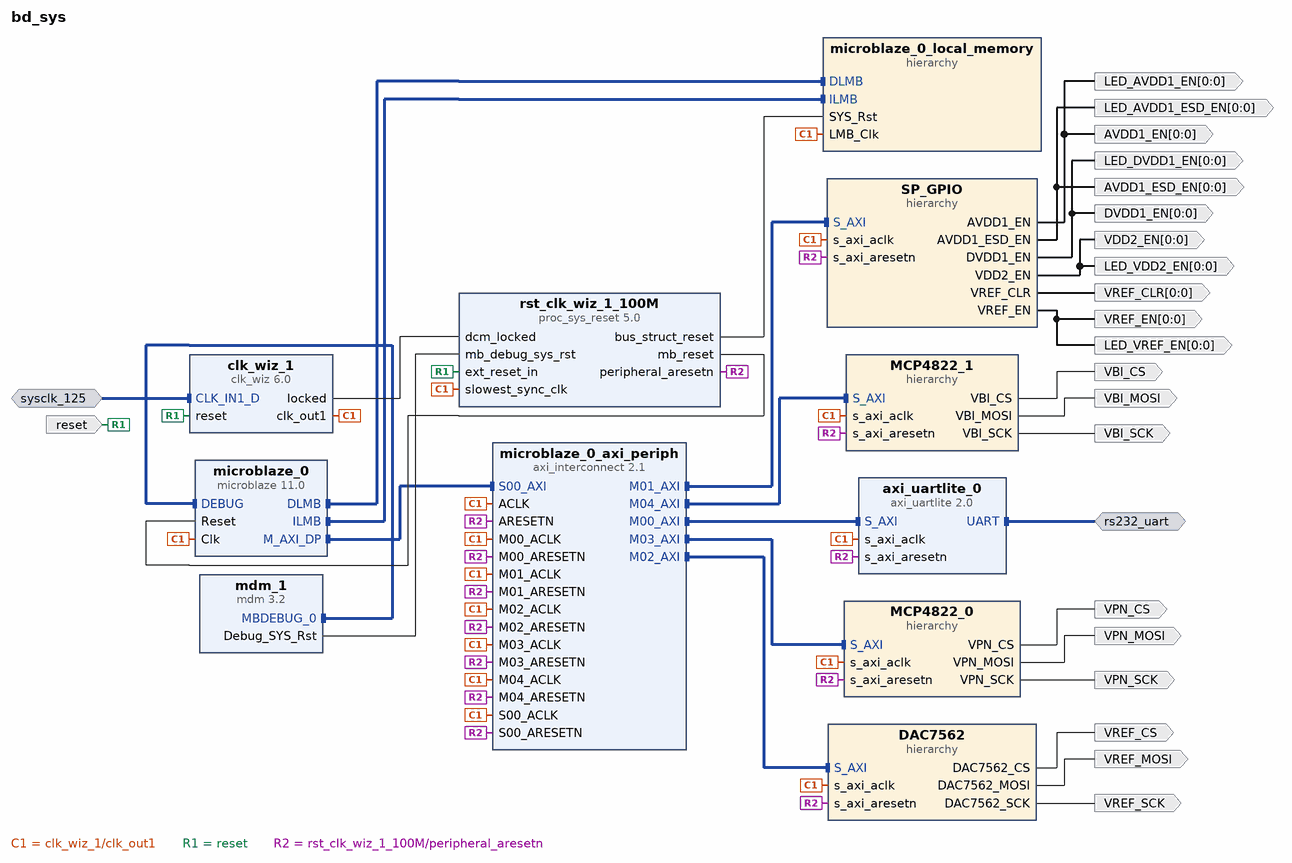
[diagram p0: block diagram of the top level]
# Vivado block design bd_sys, xcvu9p-flga2104-2L-e, Vivado 2019.1
create_bd_design bd_sys

create_bd_intf_port -mode Slave -vlnv xilinx.com:interface:diff_clock_rtl:1.0 sysclk_125
set_property -dict {CONFIG.FREQ_HZ 125000000} [get_bd_intf_ports sysclk_125]
create_bd_intf_port -mode Master -vlnv xilinx.com:interface:uart_rtl:1.0 rs232_uart
create_bd_port -dir I -type rst reset
set_property -dict {CONFIG.POLARITY ACTIVE_HIGH} [get_bd_ports reset]
create_bd_port -dir O -from 0 -to 0 AVDD1_EN
create_bd_port -dir O -from 0 -to 0 AVDD1_ESD_EN
create_bd_port -dir O -from 0 -to 0 DVDD1_EN
create_bd_port -dir O -from 0 -to 0 VDD2_EN
create_bd_port -dir O -from 0 -to 0 VREF_CLR
create_bd_port -dir O -from 0 -to 0 VREF_EN
create_bd_port -dir O -from 0 -to 0 LED_VDD2_EN
create_bd_port -dir O -from 0 -to 0 LED_AVDD1_ESD_EN
create_bd_port -dir O -from 0 -to 0 LED_AVDD1_EN
create_bd_port -dir O -from 0 -to 0 LED_DVDD1_EN
create_bd_port -dir O -from 0 -to 0 LED_VREF_EN
create_bd_port -dir O VREF_CS
create_bd_port -dir O VREF_MOSI
create_bd_port -dir O VREF_SCK
create_bd_port -dir O VPN_SCK
create_bd_port -dir O VPN_CS
create_bd_port -dir O VPN_MOSI
create_bd_port -dir O VBI_CS
create_bd_port -dir O VBI_MOSI
create_bd_port -dir O VBI_SCK

create_bd_cell -type ip -vlnv xilinx.com:ip:microblaze:11.0 microblaze_0
set_property -dict {CONFIG.C_DEBUG_ENABLED 1 CONFIG.C_D_AXI 1 CONFIG.C_D_LMB 1 CONFIG.C_I_LMB 1} [get_bd_cells microblaze_0]
create_bd_cell -type hier microblaze_0_local_memory
create_bd_cell -type ip -vlnv xilinx.com:ip:mdm:3.2 mdm_1
create_bd_cell -type ip -vlnv xilinx.com:ip:clk_wiz:6.0 clk_wiz_1
set_property -dict [list \
  CONFIG.CLKIN1_JITTER_PS 80.0 \
  CONFIG.CLKOUT1_JITTER 177.983 \
  CONFIG.CLKOUT1_PHASE_ERROR 222.305 \
  CONFIG.CLK_IN1_BOARD_INTERFACE sysclk_125 \
  CONFIG.MMCM_CLKFBOUT_MULT_F 48.000 \
  CONFIG.MMCM_CLKIN1_PERIOD 8.000 \
  CONFIG.MMCM_CLKIN2_PERIOD 10.000 \
  CONFIG.PRIM_SOURCE Differential_clock_capable_pin \
  CONFIG.RESET_BOARD_INTERFACE reset \
  CONFIG.USE_BOARD_FLOW true \
] [get_bd_cells clk_wiz_1]
create_bd_cell -type ip -vlnv xilinx.com:ip:proc_sys_reset:5.0 rst_clk_wiz_1_100M
set_property -dict {CONFIG.RESET_BOARD_INTERFACE reset CONFIG.USE_BOARD_FLOW true} [get_bd_cells rst_clk_wiz_1_100M]
create_bd_cell -type ip -vlnv xilinx.com:ip:axi_uartlite:2.0 axi_uartlite_0
set_property -dict [list \
  CONFIG.C_BAUDRATE 115200 \
  CONFIG.UARTLITE_BOARD_INTERFACE rs232_uart \
  CONFIG.USE_BOARD_FLOW true \
] [get_bd_cells axi_uartlite_0]
create_bd_cell -type ip -vlnv xilinx.com:ip:axi_interconnect:2.1 microblaze_0_axi_periph
set_property -dict {CONFIG.NUM_MI 5} [get_bd_cells microblaze_0_axi_periph]
create_bd_cell -type hier SP_GPIO
create_bd_cell -type hier DAC7562
create_bd_cell -type hier MCP4822_0
create_bd_cell -type hier MCP4822_1

# ---- hierarchy /microblaze_0_local_memory ----
current_bd_instance /microblaze_0_local_memory
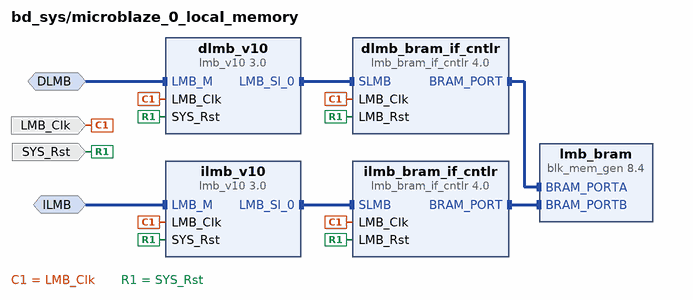
[diagram p1: block diagram inside /microblaze_0_local_memory]
create_bd_intf_pin -mode MirroredMaster -vlnv xilinx.com:interface:lmb_rtl:1.0 DLMB
create_bd_intf_pin -mode MirroredMaster -vlnv xilinx.com:interface:lmb_rtl:1.0 ILMB
create_bd_pin -dir I -type clk LMB_Clk
create_bd_pin -dir I -type rst SYS_Rst

create_bd_cell -type ip -vlnv xilinx.com:ip:lmb_v10:3.0 dlmb_v10
create_bd_cell -type ip -vlnv xilinx.com:ip:lmb_v10:3.0 ilmb_v10
create_bd_cell -type ip -vlnv xilinx.com:ip:lmb_bram_if_cntlr:4.0 dlmb_bram_if_cntlr
set_property -dict {CONFIG.C_ECC 0} [get_bd_cells dlmb_bram_if_cntlr]
create_bd_cell -type ip -vlnv xilinx.com:ip:lmb_bram_if_cntlr:4.0 ilmb_bram_if_cntlr
set_property -dict {CONFIG.C_ECC 0} [get_bd_cells ilmb_bram_if_cntlr]
create_bd_cell -type ip -vlnv xilinx.com:ip:blk_mem_gen:8.4 lmb_bram
set_property -dict {CONFIG.Memory_Type True_Dual_Port_RAM CONFIG.use_bram_block BRAM_Controller} [get_bd_cells lmb_bram]

# ---- hierarchy /SP_GPIO ----
current_bd_instance /SP_GPIO
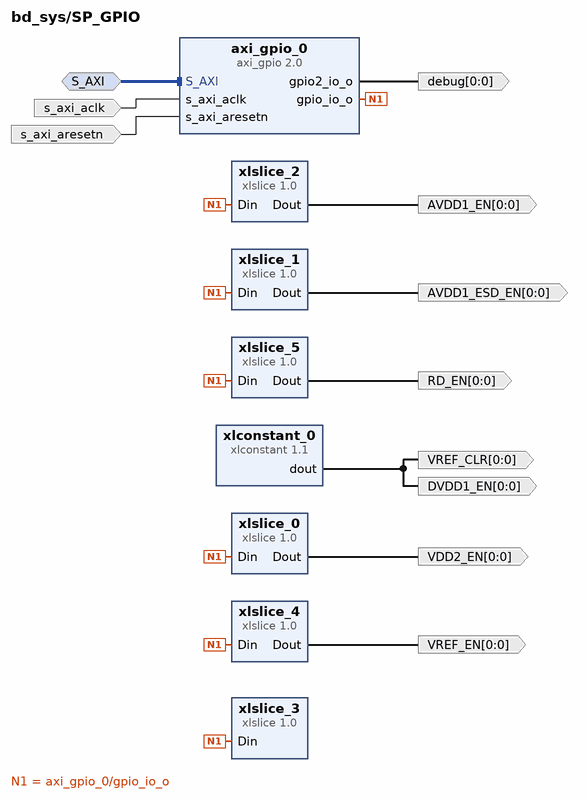
[diagram p2: block diagram inside /SP_GPIO]
create_bd_intf_pin -mode Slave -vlnv xilinx.com:interface:aximm_rtl:1.0 S_AXI
create_bd_pin -dir I -type clk s_axi_aclk
create_bd_pin -dir I -type rst s_axi_aresetn
create_bd_pin -dir O -from 0 -to 0 VREF_CLR
create_bd_pin -dir O -from 0 -to 0 VDD2_EN
create_bd_pin -dir O -from 0 -to 0 AVDD1_ESD_EN
create_bd_pin -dir O -from 0 -to 0 AVDD1_EN
create_bd_pin -dir O -from 0 -to 0 DVDD1_EN
create_bd_pin -dir O -from 0 -to 0 VREF_EN
create_bd_pin -dir O -from 0 -to 0 RD_EN
create_bd_pin -dir O -from 0 -to 0 debug

create_bd_cell -type ip -vlnv xilinx.com:ip:axi_gpio:2.0 axi_gpio_0
set_property -dict [list \
  CONFIG.C_ALL_OUTPUTS 1 \
  CONFIG.C_ALL_OUTPUTS_2 1 \
  CONFIG.C_GPIO2_WIDTH 1 \
  CONFIG.C_GPIO_WIDTH 8 \
  CONFIG.C_IS_DUAL 1 \
] [get_bd_cells axi_gpio_0]
create_bd_cell -type ip -vlnv xilinx.com:ip:xlconstant:1.1 xlconstant_0
create_bd_cell -type ip -vlnv xilinx.com:ip:xlslice:1.0 xlslice_0
set_property -dict {CONFIG.DIN_FROM 0 CONFIG.DIN_TO 0 CONFIG.DIN_WIDTH 8 CONFIG.DOUT_WIDTH 1} [get_bd_cells xlslice_0]
create_bd_cell -type ip -vlnv xilinx.com:ip:xlslice:1.0 xlslice_1
set_property -dict {CONFIG.DIN_FROM 1 CONFIG.DIN_TO 1 CONFIG.DIN_WIDTH 8 CONFIG.DOUT_WIDTH 1} [get_bd_cells xlslice_1]
create_bd_cell -type ip -vlnv xilinx.com:ip:xlslice:1.0 xlslice_2
set_property -dict {CONFIG.DIN_FROM 2 CONFIG.DIN_TO 2 CONFIG.DIN_WIDTH 8 CONFIG.DOUT_WIDTH 1} [get_bd_cells xlslice_2]
create_bd_cell -type ip -vlnv xilinx.com:ip:xlslice:1.0 xlslice_3
set_property -dict {CONFIG.DIN_FROM 3 CONFIG.DIN_TO 3 CONFIG.DIN_WIDTH 8 CONFIG.DOUT_WIDTH 1} [get_bd_cells xlslice_3]
create_bd_cell -type ip -vlnv xilinx.com:ip:xlslice:1.0 xlslice_4
set_property -dict {CONFIG.DIN_FROM 4 CONFIG.DIN_TO 4 CONFIG.DIN_WIDTH 8 CONFIG.DOUT_WIDTH 1} [get_bd_cells xlslice_4]
create_bd_cell -type ip -vlnv xilinx.com:ip:xlslice:1.0 xlslice_5
set_property -dict {CONFIG.DIN_FROM 5 CONFIG.DIN_TO 5 CONFIG.DIN_WIDTH 8 CONFIG.DOUT_WIDTH 1} [get_bd_cells xlslice_5]

# ---- hierarchy /DAC7562 ----
current_bd_instance /DAC7562
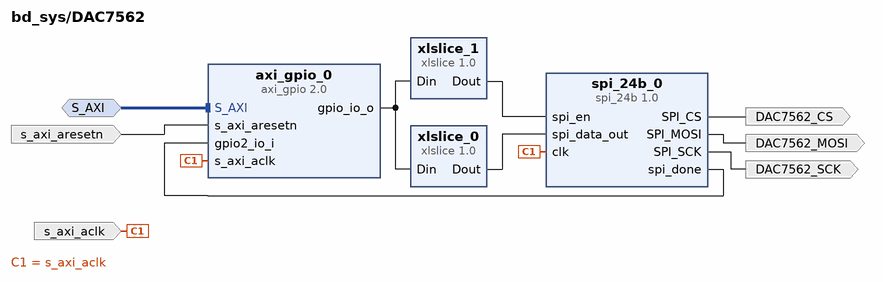
[diagram p3: block diagram inside /DAC7562]
create_bd_intf_pin -mode Slave -vlnv xilinx.com:interface:aximm_rtl:1.0 S_AXI
create_bd_pin -dir I -type clk s_axi_aclk
create_bd_pin -dir I -type rst s_axi_aresetn
create_bd_pin -dir O DAC7562_CS
create_bd_pin -dir O DAC7562_MOSI
create_bd_pin -dir O DAC7562_SCK

create_bd_cell -type ip -vlnv xilinx.com:user:spi_24b:1.0 spi_24b_0
create_bd_cell -type ip -vlnv xilinx.com:ip:axi_gpio:2.0 axi_gpio_0
set_property -dict [list \
  CONFIG.C_ALL_INPUTS_2 1 \
  CONFIG.C_ALL_OUTPUTS 1 \
  CONFIG.C_GPIO2_WIDTH 1 \
  CONFIG.C_GPIO_WIDTH 25 \
  CONFIG.C_IS_DUAL 1 \
] [get_bd_cells axi_gpio_0]
create_bd_cell -type ip -vlnv xilinx.com:ip:xlslice:1.0 xlslice_0
set_property -dict {CONFIG.DIN_FROM 24 CONFIG.DIN_TO 1 CONFIG.DIN_WIDTH 25 CONFIG.DOUT_WIDTH 24} [get_bd_cells xlslice_0]
create_bd_cell -type ip -vlnv xilinx.com:ip:xlslice:1.0 xlslice_1
set_property -dict {CONFIG.DIN_FROM 0 CONFIG.DIN_TO 0 CONFIG.DIN_WIDTH 25 CONFIG.DOUT_WIDTH 1} [get_bd_cells xlslice_1]

# ---- hierarchy /MCP4822_0 ----
current_bd_instance /MCP4822_0
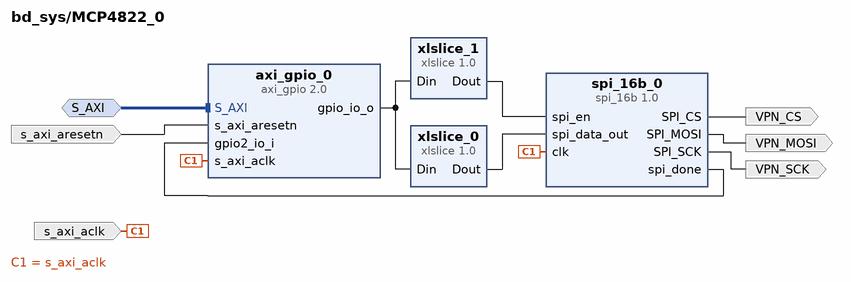
[diagram p4: block diagram inside /MCP4822_0]
create_bd_intf_pin -mode Slave -vlnv xilinx.com:interface:aximm_rtl:1.0 S_AXI
create_bd_pin -dir O VPN_SCK
create_bd_pin -dir O VPN_CS
create_bd_pin -dir O VPN_MOSI
create_bd_pin -dir I -type clk s_axi_aclk
create_bd_pin -dir I -type rst s_axi_aresetn

create_bd_cell -type ip -vlnv xilinx.com:ip:axi_gpio:2.0 axi_gpio_0
set_property -dict [list \
  CONFIG.C_ALL_INPUTS_2 1 \
  CONFIG.C_ALL_OUTPUTS 1 \
  CONFIG.C_GPIO2_WIDTH 1 \
  CONFIG.C_GPIO_WIDTH 17 \
  CONFIG.C_IS_DUAL 1 \
] [get_bd_cells axi_gpio_0]
create_bd_cell -type ip -vlnv xilinx.com:ip:xlslice:1.0 xlslice_0
set_property -dict {CONFIG.DIN_FROM 16 CONFIG.DIN_TO 1 CONFIG.DIN_WIDTH 17 CONFIG.DOUT_WIDTH 16} [get_bd_cells xlslice_0]
create_bd_cell -type ip -vlnv xilinx.com:ip:xlslice:1.0 xlslice_1
set_property -dict {CONFIG.DIN_FROM 0 CONFIG.DIN_TO 0 CONFIG.DIN_WIDTH 17} [get_bd_cells xlslice_1]
create_bd_cell -type ip -vlnv xilinx.com:user:spi_16b:1.0 spi_16b_0

# ---- hierarchy /MCP4822_1 ----
current_bd_instance /MCP4822_1
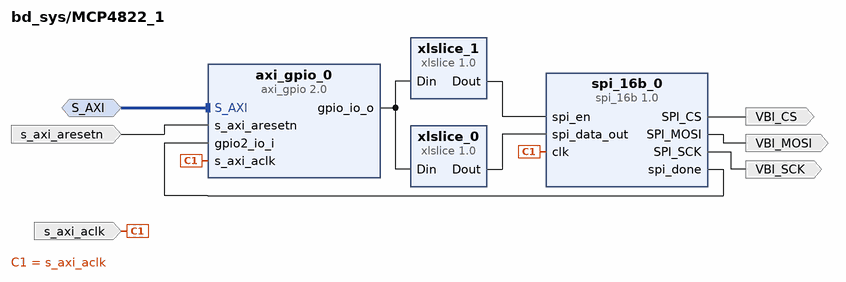
[diagram p5: block diagram inside /MCP4822_1]
create_bd_intf_pin -mode Slave -vlnv xilinx.com:interface:aximm_rtl:1.0 S_AXI
create_bd_pin -dir O VBI_SCK
create_bd_pin -dir O VBI_CS
create_bd_pin -dir O VBI_MOSI
create_bd_pin -dir I -type clk s_axi_aclk
create_bd_pin -dir I -type rst s_axi_aresetn

create_bd_cell -type ip -vlnv xilinx.com:ip:axi_gpio:2.0 axi_gpio_0
set_property -dict [list \
  CONFIG.C_ALL_INPUTS_2 1 \
  CONFIG.C_ALL_OUTPUTS 1 \
  CONFIG.C_GPIO2_WIDTH 1 \
  CONFIG.C_GPIO_WIDTH 17 \
  CONFIG.C_IS_DUAL 1 \
] [get_bd_cells axi_gpio_0]
create_bd_cell -type ip -vlnv xilinx.com:ip:xlslice:1.0 xlslice_0
set_property -dict {CONFIG.DIN_FROM 16 CONFIG.DIN_TO 1 CONFIG.DIN_WIDTH 17 CONFIG.DOUT_WIDTH 16} [get_bd_cells xlslice_0]
create_bd_cell -type ip -vlnv xilinx.com:ip:xlslice:1.0 xlslice_1
set_property -dict {CONFIG.DIN_FROM 0 CONFIG.DIN_TO 0 CONFIG.DIN_WIDTH 17} [get_bd_cells xlslice_1]
create_bd_cell -type ip -vlnv xilinx.com:user:spi_16b:1.0 spi_16b_0

# ---- connections ----

current_bd_instance /microblaze_0_local_memory
connect_bd_intf_net -intf_net microblaze_0_dlmb_bus [get_bd_intf_pins dlmb_v10/LMB_Sl_0] [get_bd_intf_pins dlmb_bram_if_cntlr/SLMB]
connect_bd_intf_net -intf_net microblaze_0_dlmb [get_bd_intf_pins DLMB] [get_bd_intf_pins dlmb_v10/LMB_M]
connect_bd_intf_net -intf_net microblaze_0_ilmb_cntlr [get_bd_intf_pins ilmb_bram_if_cntlr/BRAM_PORT] [get_bd_intf_pins lmb_bram/BRAM_PORTB]
connect_bd_intf_net -intf_net microblaze_0_ilmb_bus [get_bd_intf_pins ilmb_v10/LMB_Sl_0] [get_bd_intf_pins ilmb_bram_if_cntlr/SLMB]
connect_bd_intf_net -intf_net microblaze_0_dlmb_cntlr [get_bd_intf_pins dlmb_bram_if_cntlr/BRAM_PORT] [get_bd_intf_pins lmb_bram/BRAM_PORTA]
connect_bd_intf_net -intf_net microblaze_0_ilmb [get_bd_intf_pins ILMB] [get_bd_intf_pins ilmb_v10/LMB_M]
connect_bd_net -net microblaze_0_Clk [get_bd_pins LMB_Clk] \
  [get_bd_pins dlmb_v10/LMB_Clk] [get_bd_pins dlmb_bram_if_cntlr/LMB_Clk] [get_bd_pins ilmb_v10/LMB_Clk] \
  [get_bd_pins ilmb_bram_if_cntlr/LMB_Clk]
connect_bd_net [get_bd_pins SYS_Rst] \
  [get_bd_pins dlmb_v10/SYS_Rst] [get_bd_pins dlmb_bram_if_cntlr/LMB_Rst] [get_bd_pins ilmb_v10/SYS_Rst] \
  [get_bd_pins ilmb_bram_if_cntlr/LMB_Rst]
set_property HDL_ATTRIBUTE.BMM_INFO_ADDRESS_SPACE {byte  0x00000000 32 > bd_sys microblaze_0_local_memory/lmb_bram} [get_bd_cells dlmb_bram_if_cntlr]
set_property HDL_ATTRIBUTE.KEEP_HIERARCHY yes [get_bd_cells dlmb_bram_if_cntlr]

current_bd_instance /SP_GPIO
connect_bd_intf_net [get_bd_intf_pins S_AXI] [get_bd_intf_pins axi_gpio_0/S_AXI]
connect_bd_net -net s_axi_aclk_0_1 [get_bd_pins s_axi_aclk] [get_bd_pins axi_gpio_0/s_axi_aclk]
connect_bd_net -net s_axi_aresetn_0_1 [get_bd_pins s_axi_aresetn] [get_bd_pins axi_gpio_0/s_axi_aresetn]
connect_bd_net [get_bd_pins axi_gpio_0/gpio_io_o] \
  [get_bd_pins xlslice_0/Din] [get_bd_pins xlslice_1/Din] [get_bd_pins xlslice_2/Din] [get_bd_pins xlslice_3/Din] \
  [get_bd_pins xlslice_4/Din] [get_bd_pins xlslice_5/Din]
connect_bd_net [get_bd_pins xlslice_1/Dout] [get_bd_pins AVDD1_ESD_EN]
connect_bd_net [get_bd_pins xlslice_2/Dout] [get_bd_pins AVDD1_EN]
connect_bd_net [get_bd_pins xlslice_4/Dout] [get_bd_pins VREF_EN]
connect_bd_net [get_bd_pins xlslice_5/Dout] [get_bd_pins RD_EN]
connect_bd_net [get_bd_pins axi_gpio_0/gpio2_io_o] [get_bd_pins debug]
connect_bd_net [get_bd_pins xlconstant_0/dout] [get_bd_pins VREF_CLR] [get_bd_pins DVDD1_EN]
connect_bd_net [get_bd_pins xlslice_0/Dout] [get_bd_pins VDD2_EN]

current_bd_instance /DAC7562
connect_bd_intf_net [get_bd_intf_pins S_AXI] [get_bd_intf_pins axi_gpio_0/S_AXI]
connect_bd_net [get_bd_pins axi_gpio_0/gpio_io_o] [get_bd_pins xlslice_0/Din] [get_bd_pins xlslice_1/Din]
connect_bd_net [get_bd_pins xlslice_0/Dout] [get_bd_pins spi_24b_0/spi_data_out]
connect_bd_net [get_bd_pins xlslice_1/Dout] [get_bd_pins spi_24b_0/spi_en]
connect_bd_net [get_bd_pins spi_24b_0/spi_done] [get_bd_pins axi_gpio_0/gpio2_io_i]
connect_bd_net -net s_axi_aclk_0_1 [get_bd_pins s_axi_aclk] [get_bd_pins axi_gpio_0/s_axi_aclk] [get_bd_pins spi_24b_0/clk]
connect_bd_net -net s_axi_aresetn_0_1 [get_bd_pins s_axi_aresetn] [get_bd_pins axi_gpio_0/s_axi_aresetn]
connect_bd_net [get_bd_pins spi_24b_0/SPI_CS] [get_bd_pins DAC7562_CS]
connect_bd_net [get_bd_pins spi_24b_0/SPI_MOSI] [get_bd_pins DAC7562_MOSI]
connect_bd_net [get_bd_pins spi_24b_0/SPI_SCK] [get_bd_pins DAC7562_SCK]

current_bd_instance /MCP4822_0
connect_bd_intf_net [get_bd_intf_pins S_AXI] [get_bd_intf_pins axi_gpio_0/S_AXI]
connect_bd_net [get_bd_pins axi_gpio_0/gpio_io_o] [get_bd_pins xlslice_1/Din] [get_bd_pins xlslice_0/Din]
connect_bd_net [get_bd_pins xlslice_0/Dout] [get_bd_pins spi_16b_0/spi_data_out]
connect_bd_net [get_bd_pins xlslice_1/Dout] [get_bd_pins spi_16b_0/spi_en]
connect_bd_net [get_bd_pins spi_16b_0/spi_done] [get_bd_pins axi_gpio_0/gpio2_io_i]
connect_bd_net [get_bd_pins spi_16b_0/SPI_SCK] [get_bd_pins VPN_SCK]
connect_bd_net [get_bd_pins spi_16b_0/SPI_CS] [get_bd_pins VPN_CS]
connect_bd_net [get_bd_pins spi_16b_0/SPI_MOSI] [get_bd_pins VPN_MOSI]
connect_bd_net -net s_axi_aclk_0_1 [get_bd_pins s_axi_aclk] [get_bd_pins axi_gpio_0/s_axi_aclk] [get_bd_pins spi_16b_0/clk]
connect_bd_net -net s_axi_aresetn_0_1 [get_bd_pins s_axi_aresetn] [get_bd_pins axi_gpio_0/s_axi_aresetn]

current_bd_instance /MCP4822_1
connect_bd_intf_net [get_bd_intf_pins S_AXI] [get_bd_intf_pins axi_gpio_0/S_AXI]
connect_bd_net [get_bd_pins axi_gpio_0/gpio_io_o] [get_bd_pins xlslice_1/Din] [get_bd_pins xlslice_0/Din]
connect_bd_net [get_bd_pins xlslice_0/Dout] [get_bd_pins spi_16b_0/spi_data_out]
connect_bd_net [get_bd_pins xlslice_1/Dout] [get_bd_pins spi_16b_0/spi_en]
connect_bd_net [get_bd_pins spi_16b_0/spi_done] [get_bd_pins axi_gpio_0/gpio2_io_i]
connect_bd_net [get_bd_pins spi_16b_0/SPI_SCK] [get_bd_pins VBI_SCK]
connect_bd_net [get_bd_pins spi_16b_0/SPI_CS] [get_bd_pins VBI_CS]
connect_bd_net [get_bd_pins spi_16b_0/SPI_MOSI] [get_bd_pins VBI_MOSI]
connect_bd_net -net s_axi_aclk_0_1 [get_bd_pins s_axi_aclk] [get_bd_pins axi_gpio_0/s_axi_aclk] [get_bd_pins spi_16b_0/clk]
connect_bd_net -net s_axi_aresetn_0_1 [get_bd_pins s_axi_aresetn] [get_bd_pins axi_gpio_0/s_axi_aresetn]

current_bd_instance /
connect_bd_intf_net -intf_net sysclk_125_1 [get_bd_intf_ports sysclk_125] [get_bd_intf_pins clk_wiz_1/CLK_IN1_D]
connect_bd_intf_net [get_bd_intf_pins microblaze_0/DLMB] [get_bd_intf_pins microblaze_0_local_memory/DLMB]
connect_bd_intf_net [get_bd_intf_pins microblaze_0/M_AXI_DP] [get_bd_intf_pins microblaze_0_axi_periph/S00_AXI]
connect_bd_intf_net [get_bd_intf_pins microblaze_0/ILMB] [get_bd_intf_pins microblaze_0_local_memory/ILMB]
connect_bd_intf_net [get_bd_intf_pins microblaze_0_axi_periph/M02_AXI] [get_bd_intf_pins DAC7562/S_AXI]
connect_bd_intf_net [get_bd_intf_pins microblaze_0_axi_periph/M01_AXI] [get_bd_intf_pins SP_GPIO/S_AXI]
connect_bd_intf_net [get_bd_intf_pins microblaze_0_axi_periph/M03_AXI] [get_bd_intf_pins MCP4822_0/S_AXI]
connect_bd_intf_net [get_bd_intf_pins microblaze_0_axi_periph/M04_AXI] [get_bd_intf_pins MCP4822_1/S_AXI]
connect_bd_intf_net [get_bd_intf_pins mdm_1/MBDEBUG_0] [get_bd_intf_pins microblaze_0/DEBUG]
connect_bd_intf_net [get_bd_intf_pins microblaze_0_axi_periph/M00_AXI] [get_bd_intf_pins axi_uartlite_0/S_AXI]
connect_bd_intf_net [get_bd_intf_ports rs232_uart] [get_bd_intf_pins axi_uartlite_0/UART]
connect_bd_net -net microblaze_0_Clk [get_bd_pins clk_wiz_1/clk_out1] \
  [get_bd_pins microblaze_0/Clk] [get_bd_pins microblaze_0_local_memory/LMB_Clk] \
  [get_bd_pins rst_clk_wiz_1_100M/slowest_sync_clk] [get_bd_pins microblaze_0_axi_periph/S00_ACLK] \
  [get_bd_pins axi_uartlite_0/s_axi_aclk] [get_bd_pins microblaze_0_axi_periph/M00_ACLK] \
  [get_bd_pins microblaze_0_axi_periph/ACLK] [get_bd_pins SP_GPIO/s_axi_aclk] [get_bd_pins microblaze_0_axi_periph/M01_ACLK] \
  [get_bd_pins DAC7562/s_axi_aclk] [get_bd_pins microblaze_0_axi_periph/M02_ACLK] [get_bd_pins MCP4822_0/s_axi_aclk] \
  [get_bd_pins microblaze_0_axi_periph/M03_ACLK] [get_bd_pins MCP4822_1/s_axi_aclk] \
  [get_bd_pins microblaze_0_axi_periph/M04_ACLK]
connect_bd_net [get_bd_pins clk_wiz_1/locked] [get_bd_pins rst_clk_wiz_1_100M/dcm_locked]
connect_bd_net [get_bd_pins rst_clk_wiz_1_100M/mb_reset] [get_bd_pins microblaze_0/Reset]
connect_bd_net [get_bd_pins rst_clk_wiz_1_100M/bus_struct_reset] [get_bd_pins microblaze_0_local_memory/SYS_Rst]
connect_bd_net [get_bd_pins mdm_1/Debug_SYS_Rst] [get_bd_pins rst_clk_wiz_1_100M/mb_debug_sys_rst]
connect_bd_net [get_bd_ports reset] [get_bd_pins clk_wiz_1/reset] [get_bd_pins rst_clk_wiz_1_100M/ext_reset_in]
connect_bd_net [get_bd_pins rst_clk_wiz_1_100M/peripheral_aresetn] \
  [get_bd_pins microblaze_0_axi_periph/S00_ARESETN] [get_bd_pins axi_uartlite_0/s_axi_aresetn] \
  [get_bd_pins microblaze_0_axi_periph/M00_ARESETN] [get_bd_pins microblaze_0_axi_periph/ARESETN] \
  [get_bd_pins SP_GPIO/s_axi_aresetn] [get_bd_pins microblaze_0_axi_periph/M01_ARESETN] [get_bd_pins DAC7562/s_axi_aresetn] \
  [get_bd_pins microblaze_0_axi_periph/M02_ARESETN] [get_bd_pins MCP4822_0/s_axi_aresetn] \
  [get_bd_pins microblaze_0_axi_periph/M03_ARESETN] [get_bd_pins MCP4822_1/s_axi_aresetn] \
  [get_bd_pins microblaze_0_axi_periph/M04_ARESETN]
connect_bd_net [get_bd_pins SP_GPIO/AVDD1_EN] [get_bd_ports AVDD1_EN] [get_bd_ports LED_AVDD1_EN]
connect_bd_net [get_bd_pins SP_GPIO/AVDD1_ESD_EN] [get_bd_ports AVDD1_ESD_EN] [get_bd_ports LED_AVDD1_ESD_EN]
connect_bd_net [get_bd_pins SP_GPIO/DVDD1_EN] [get_bd_ports DVDD1_EN] [get_bd_ports LED_DVDD1_EN]
connect_bd_net [get_bd_pins SP_GPIO/VDD2_EN] [get_bd_ports VDD2_EN] [get_bd_ports LED_VDD2_EN]
connect_bd_net [get_bd_pins SP_GPIO/VREF_CLR] [get_bd_ports VREF_CLR]
connect_bd_net [get_bd_pins SP_GPIO/VREF_EN] [get_bd_ports VREF_EN] [get_bd_ports LED_VREF_EN]
connect_bd_net [get_bd_pins DAC7562/DAC7562_CS] [get_bd_ports VREF_CS]
connect_bd_net [get_bd_pins DAC7562/DAC7562_MOSI] [get_bd_ports VREF_MOSI]
connect_bd_net [get_bd_pins DAC7562/DAC7562_SCK] [get_bd_ports VREF_SCK]
connect_bd_net -net MCP4822_0_SPI_SCK_0 [get_bd_pins MCP4822_0/VPN_SCK] [get_bd_ports VPN_SCK]
connect_bd_net -net MCP4822_0_SPI_CS_0 [get_bd_pins MCP4822_0/VPN_CS] [get_bd_ports VPN_CS]
connect_bd_net -net MCP4822_0_SPI_MOSI_0 [get_bd_pins MCP4822_0/VPN_MOSI] [get_bd_ports VPN_MOSI]
connect_bd_net [get_bd_pins MCP4822_1/VBI_CS] [get_bd_ports VBI_CS]
connect_bd_net [get_bd_pins MCP4822_1/VBI_MOSI] [get_bd_ports VBI_MOSI]
connect_bd_net [get_bd_pins MCP4822_1/VBI_SCK] [get_bd_ports VBI_SCK]
set_property HDL_ATTRIBUTE.BMM_INFO_PROCESSOR {microblaze-le > bd_sys microblaze_0_local_memory/dlmb_bram_if_cntlr} [get_bd_cells microblaze_0]
set_property HDL_ATTRIBUTE.KEEP_HIERARCHY yes [get_bd_cells microblaze_0]

# ---- address map ----
assign_bd_address -offset 0x00000000 -range 256K -target_address_space [get_bd_addr_spaces microblaze_0/Data] [get_bd_addr_segs microblaze_0_local_memory/dlmb_bram_if_cntlr/SLMB/Mem]
assign_bd_address -offset 0x40000000 -range 64K -target_address_space [get_bd_addr_spaces microblaze_0/Data] [get_bd_addr_segs SP_GPIO/axi_gpio_0/S_AXI/Reg]
assign_bd_address -offset 0x40010000 -range 64K -target_address_space [get_bd_addr_spaces microblaze_0/Data] [get_bd_addr_segs DAC7562/axi_gpio_0/S_AXI/Reg]
assign_bd_address -offset 0x40020000 -range 64K -target_address_space [get_bd_addr_spaces microblaze_0/Data] [get_bd_addr_segs MCP4822_0/axi_gpio_0/S_AXI/Reg]
assign_bd_address -offset 0x40030000 -range 64K -target_address_space [get_bd_addr_spaces microblaze_0/Data] [get_bd_addr_segs MCP4822_1/axi_gpio_0/S_AXI/Reg]
assign_bd_address -offset 0x40600000 -range 64K -target_address_space [get_bd_addr_spaces microblaze_0/Data] [get_bd_addr_segs axi_uartlite_0/S_AXI/Reg]
assign_bd_address -offset 0x00000000 -range 256K -target_address_space [get_bd_addr_spaces microblaze_0/Instruction] [get_bd_addr_segs microblaze_0_local_memory/ilmb_bram_if_cntlr/SLMB/Mem]

validate_bd_design
save_bd_design
